# EAGLE design control board V2 (EAGLE 7.7.0)
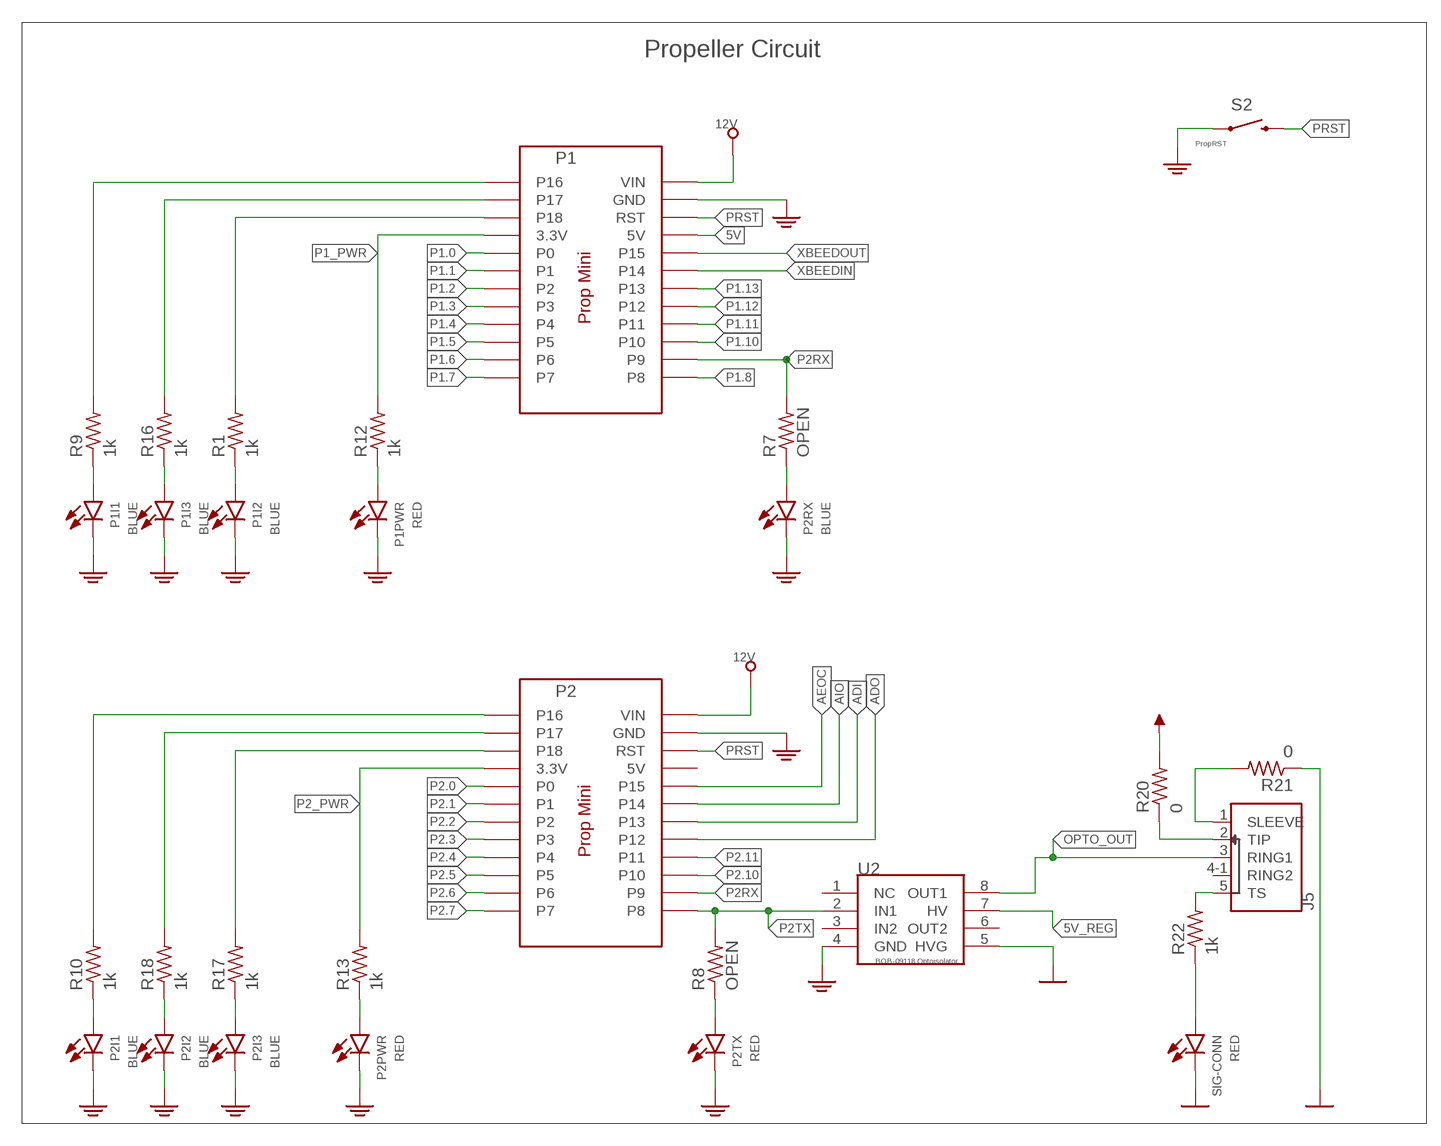
[diagram p0: schematic, sheet 1, part 1 of 2]
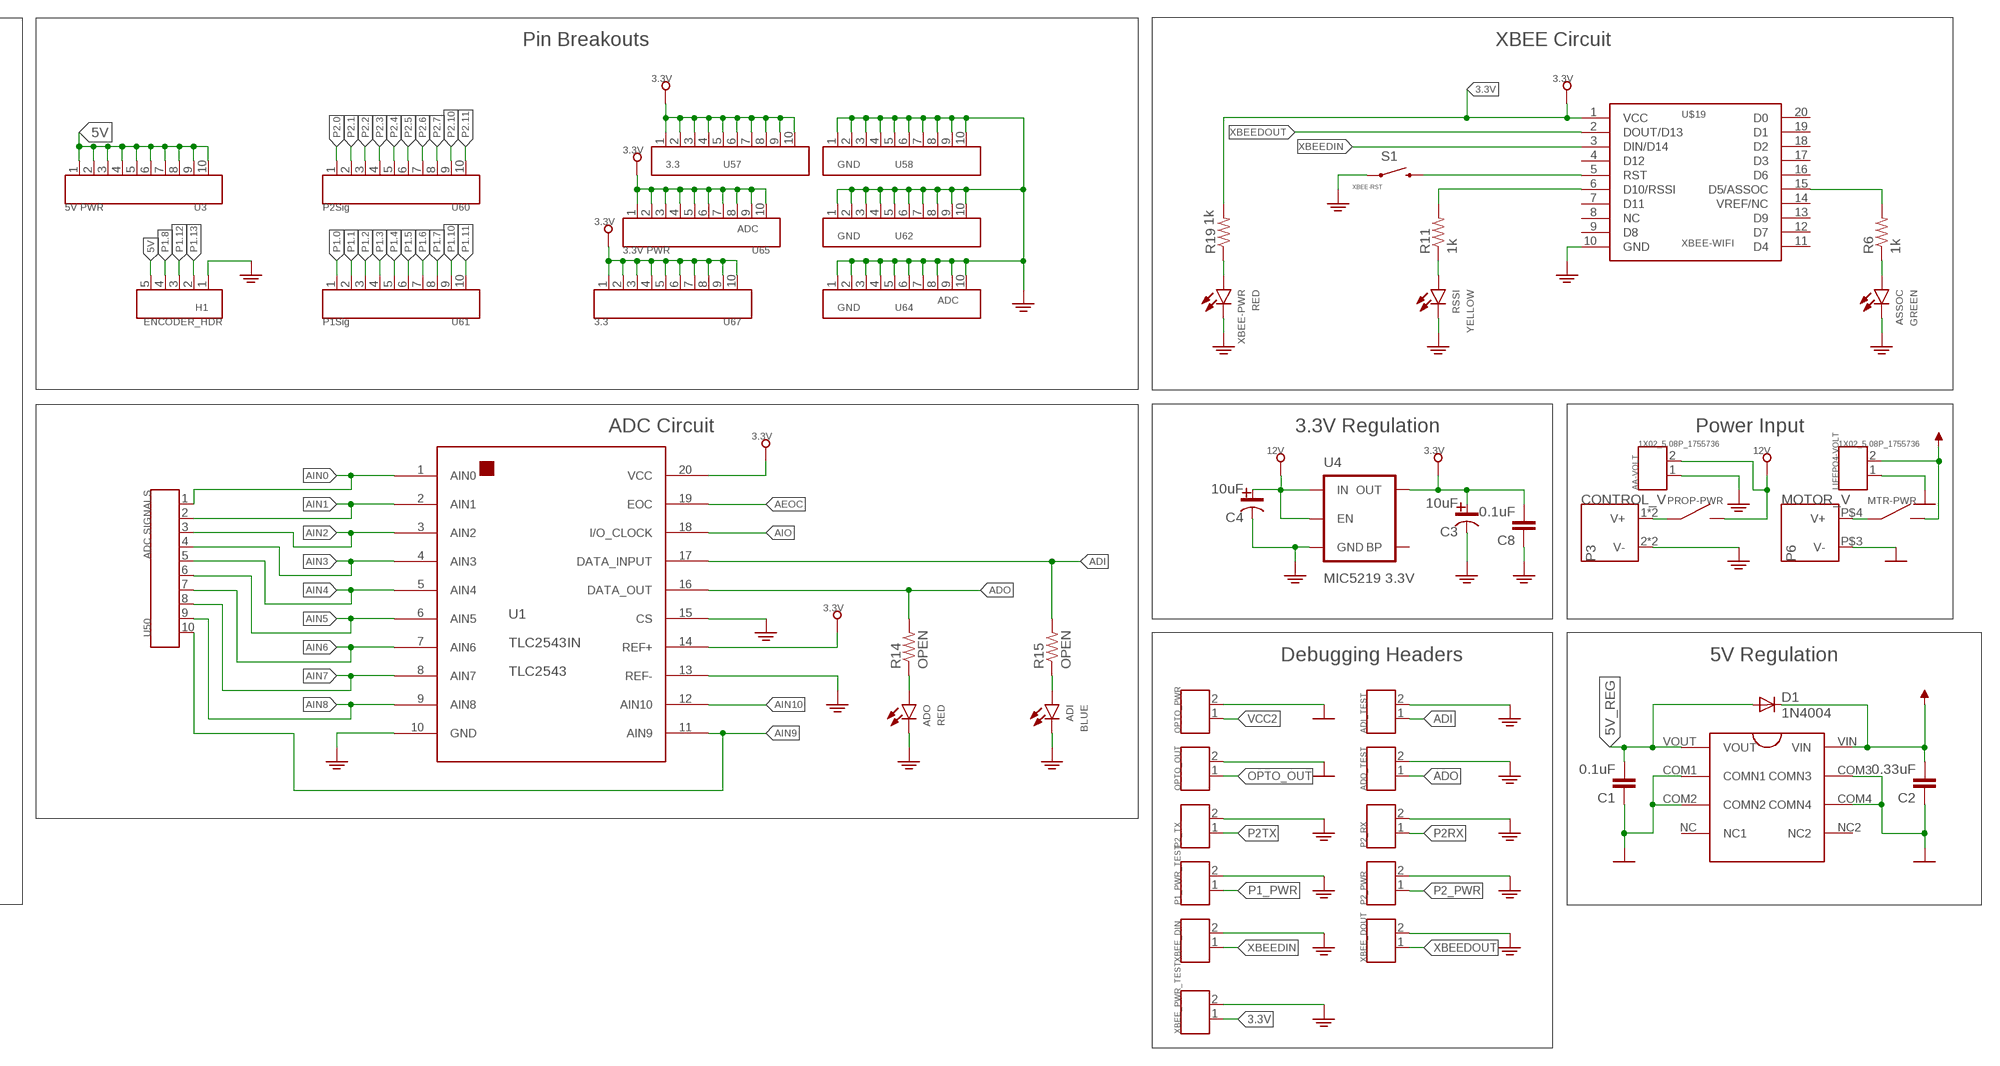
[diagram p1: schematic, sheet 1, part 2 of 2]

## Parts
AA-VOLT  1X02_5.08P_1755736  [DIP5.08MM-1X02]
ADI  BLUE  LED-STD  [0603]
ADI_TEST  1X02  [DIP0.1-1X02]
ADO  RED  LED-STD  [0603]
ADO_TEST  1X02  [DIP0.1-1X02]
ASSOC  GREEN  LED-STD  [0603]
C1  0.1uF  C0603  [0603]
C2  0.33uF  C0603  [0603]
C3  10uF  C-POL-T  [0603-POL]
C4  10uF  C-POL-T  [0603-POL]
C8  0.1uF  C0603  [0603]
D1  1N4004  [DO41-10]
H1  ENCODER_HDR  1X05  [DIP0.1-1X05]
J5  SJ1-42535TS  [SJ1-42534-SMT]
LIFEPO4-VOLT  1X02_5.08P_1755736  [DIP5.08MM-1X02]
MTR-PWR  A11JP  [NKK-SP-ASERIES]
OPTO_OUT  1X02  [DIP0.1-1X02]
OPTO_PWR  1X02  [DIP0.1-1X02]
P1  PROP-MINI  [PROP-MINI]
P1_PWR_TEST  1X02  [DIP0.1-1X02]
P1I1  BLUE  LED-STD  [0603]
P1I2  BLUE  LED-STD  [0603]
P1I3  BLUE  LED-STD  [0603]
P1PWR  RED  LED-STD  [0603]
P2  PROP-MINI  [PROP-MINI]
P2_PWR  1X02  [DIP0.1-1X02]
P2_RX  1X02  [DIP0.1-1X02]
P2_TX  1X02  [DIP0.1-1X02]
P2I1  BLUE  LED-STD  [0603]
P2I2  BLUE  LED-STD  [0603]
P2I3  BLUE  LED-STD  [0603]
P2PWR  RED  LED-STD  [0603]
P2RX  BLUE  LED-STD  [0603]
P2TX  RED  LED-STD  [0603]
P3  CONTROL_V  SINGLE-LINEPJ-014DH-SMT  [PJ-002BH-SMT-TR]
P6  MOTOR_V  SINGLE-LINE'  [PJ-037A]
PROP-PWR  A11JP  [NKK-SP-ASERIES]
R1  1k  R0603  [0603]
R6  1k  R0603  [0603]
R7  OPEN  R0603  [0603]
R8  OPEN  R0603  [0603]
R9  1k  R0603  [0603]
R10  1k  R0603  [0603]
R11  1k  R0603  [0603]
R12  1k  R0603  [0603]
R13  1k  R0603  [0603]
R14  OPEN  R0603  [0603]
R15  OPEN  R0603  [0603]
R16  1k  R0603  [0603]
R17  1k  R0603  [0603]
R18  1k  R0603  [0603]
R19  1k  R0603  [0603]
R20  0  R0603  [0603]
R21  0  R0603  [0603]
R22  1k  R0603  [0603]
RSSI  YELLOW  LED-STD  [0603]
S1  XBEE-RST  SWITCH-MOMENTARY-2SMD-2  [TACTILE_SWITCH_SMD-2]
S2  PropRST  SWITCH-MOMENTARY-2SMD-2  [TACTILE_SWITCH_SMD-2]
SIG-CONN  RED  LED-STD  [0603]
U1  TLC2543IN  [DIL-20]
U2  BOB-09118  [DIL08-0.1P-6W]
U3  5V PWR  1X10  [DIP0.1-1X10]
U4  MIC5219 3.3V  V_REG_MIC52193.3V  [SOT23-5]
U50  ADC SIGNALS  1X10  [DIP0.1-1X10]
U57  3.3  1X10  [DIP0.1-1X10]
U58  GND  1X10  [DIP0.1-1X10]
U60  P2Sig  1X10  [DIP0.1-1X10]
U61  P1Sig  1X10  [DIP0.1-1X10]
U62  GND  1X10  [DIP0.1-1X10]
U64  GND  1X10  [DIP0.1-1X10]
U65  3.3V PWR  1X10  [DIP0.1-1X10]
U67  3.3  1X10  [DIP0.1-1X10]
U70  R-PDSO-G8  [UA78L05ACDR]
U$19  XBEE-WIFI  [XBEE-STD]
XBEE-PWR  RED  LED-STD  [0603]
XBEE_DIN  1X02  [DIP0.1-1X02]
XBEE_DOUT  1X02  [DIP0.1-1X02]
XBEE_PWR_TEST  1X02  [DIP0.1-1X02]

## Nets
3.3V: C3.2 C8.2 R19.2 U1.14(REF+) U1.20(VCC) U4.5(OUT) U57.1 U57.2 U57.3 U57.4 U57.5 U57.6 U57.7 U57.8 U57.9 U57.10 U65.1 U65.2 U65.3 U65.4 U65.5 U65.6 U65.7 U65.8 U65.9 U65.10 U67.1 U67.2 U67.3 U67.4 U67.5 U67.6 U67.7 U67.8 U67.9 U67.10 U$19.1(VCC) XBEE_PWR_TEST.1
5V: H1.5 P1.5V U3.1 U3.2 U3.3 U3.4 U3.5 U3.6 U3.7 U3.8 U3.9 U3.10
5V_REG: C1.2 D1.A U2.7(HV) U70.VOUT
12V: AA-VOLT.2 C4.2 P1.VIN P2.VIN PROP-PWR.3 U4.1(IN) U4.3(EN)
ADI: ADI_TEST.1 P2.P13 R15.2 U1.17(DATA_INPUT)
ADO: ADO_TEST.1 P2.P12 R14.2 U1.16(DATA_OUT)
AEOC: P2.P15 U1.19(EOC)
AIN0: U1.1(AIN0) U50.1
AIN1: U1.2(AIN1) U50.2
AIN2: U1.3(AIN2) U50.3
AIN3: U1.4(AIN3) U50.4
AIN4: U1.5(AIN4) U50.5
AIN5: U1.6(AIN5) U50.6
AIN6: U1.7(AIN6) U50.7
AIN7: U1.8(AIN7) U50.8
AIN8: U1.9(AIN8) U50.9
AIN9: U1.11(AIN9) U50.10
AIN10: U1.12(AIN10)
AIO: P2.P14 U1.18(I/O_CLOCK)
GND: AA-VOLT.1 ADI.OUT ADI_TEST.2 ADO.OUT ADO_TEST.2 ASSOC.OUT C3.1 C4.1 C8.1 H1.1 P1.GND P1_PWR_TEST.2 P1I1.OUT P1I2.OUT P1I3.OUT P1PWR.OUT P2.GND P2_PWR.2 P2_RX.2 P2_TX.2 P2I1.OUT P2I2.OUT P2I3.OUT P2PWR.OUT P2RX.OUT P2TX.OUT P3.2(V-) P3.3(V-) RSSI.OUT S1.2 S2.2 U1.10(GND) U1.13(REF-) U1.15(CS) U2.4(GND) U4.2(GND) U58.1 U58.2 U58.3 U58.4 U58.5 U58.6 U58.7 U58.8 U58.9 U58.10 U62.1 U62.2 U62.3 U62.4 U62.5 U62.6 U62.7 U62.8 U62.9 U62.10 U64.1 U64.2 U64.3 U64.4 U64.5 U64.6 U64.7 U64.8 U64.9 U64.10 U$19.10(GND) XBEE-PWR.OUT XBEE_DIN.2 XBEE_DOUT.2 XBEE_PWR_TEST.2
GND2: C1.1 C2.1 LIFEPO4-VOLT.1 OPTO_OUT.2 OPTO_PWR.2 P6.P$3(V-) R21.1 SIG-CONN.OUT U2.5(HVG) U70.COM1(COMN1) U70.COM2(COMN2) U70.COM3(COMN3) U70.COM4(COMN4)
N$1: P3.1(V+) P3.1.(V+) PROP-PWR.1
N$2: P1I1.IN R9.1
N$3: P1.P18 R1.2
N$4: ADO.IN R14.1
N$5: R11.1 RSSI.IN
N$6: ADI.IN R15.1
N$7: MTR-PWR.1 P6.P$4(V+)
N$9: R6.2 U$19.15(D5/ASSOC)
N$10: ASSOC.IN R6.1
N$12: P1I3.IN R16.1
N$14: P1I2.IN R1.1
N$15: P1PWR.IN R12.1
N$16: R19.1 XBEE-PWR.IN
N$17: J5.1(SLEEVE) R21.2
N$18: P2RX.IN R7.1
N$19: P2I1.IN R10.1
N$20: S1.1 U$19.5(RST)
N$22: R11.2 U$19.6(D10/RSSI)
N$23: P1.P16 R9.2
N$24: P2I2.IN R18.1
N$25: P2.P16 R10.2
N$26: P2I3.IN R17.1
N$27: P1.P17 R16.2
N$28: P2PWR.IN R13.1
N$29: P2.P18 R17.2
N$30: P2TX.IN R8.1
N$31: P2.P17 R18.2
N$32: J5.2(TIP) R20.1
N$33: R22.1 SIG-CONN.IN
N$34: J5.5(TS) R22.2
OPTO_OUT: J5.3(RING1) OPTO_OUT.1 U2.8(OUT1)
P1.0: P1.P0 U61.1
P1.1: P1.P1 U61.2
P1.2: P1.P2 U61.3
P1.3: P1.P3 U61.4
P1.4: P1.P4 U61.5
P1.5: P1.P5 U61.6
P1.6: P1.P6 U61.7
P1.7: P1.P7 U61.8
P1.8: H1.4 P1.P8
P1.10: P1.P10 U61.9
P1.11: P1.P11 U61.10
P1.12: H1.3 P1.P12
P1.13: H1.2 P1.P13
P1_PWR: P1.3.3V P1_PWR_TEST.1 R12.2
P2.0: P2.P0 U60.1
P2.1: P2.P1 U60.2
P2.2: P2.P2 U60.3
P2.3: P2.P3 U60.4
P2.4: P2.P4 U60.5
P2.5: P2.P5 U60.6
P2.6: P2.P6 U60.7
P2.7: P2.P7 U60.8
P2.10: P2.P10 U60.9
P2.11: P2.P11 U60.10
P2_PWR: P2.3.3V P2_PWR.1 R13.2
P2RX: P1.P9 P2.P9 P2_RX.1 R7.2
P2TX: P2.P8 P2_TX.1 R8.2 U2.2(IN1)
PRST: P1.RST P2.RST S2.1
VCC2: C2.2 D1.C LIFEPO4-VOLT.2 MTR-PWR.3 OPTO_PWR.1 R20.2 U70.VIN
XBEEDIN: P1.P14 U$19.3(DIN/D14) XBEE_DIN.1
XBEEDOUT: P1.P15 U$19.2(DOUT/D13) XBEE_DOUT.1
Unconnected: J5.4-1(RING2) P2.5V U2.1(NC) U2.3(IN2) U2.6(OUT2) U4.4(BP) U70.NC2 U70.NC(NC1) U$19.4(D12) U$19.7(D11) U$19.8(NC) U$19.9(D8) U$19.11(D4) U$19.12(D7) U$19.13(D9) U$19.14(VREF/NC) U$19.16(D6) U$19.17(D3) U$19.18(D2) U$19.19(D1) U$19.20(D0)

## Notes on the sheet
- Propeller Circuit | Pin Breakouts | XBEE Circuit
- ADC
- ADC
- ADC Circuit | 3.3V Regulation | Power Input
- Debugging Headers | 5V Regulation

## Library data of the parts
AA-VOLT LIFEPO4-VOLT = headers:1X02_5.08P_1755736
ADI ADO ASSOC P1I1-P1I3 P1PWR P2I1-P2I3 P2PWR P2RX P2TX RSSI SIG-CONN XBEE-PWR = led:LED-STD
ADI_TEST ADO_TEST OPTO_OUT OPTO_PWR P1_PWR_TEST P2_PWR P2_RX P2_TX XBEE_DIN XBEE_DOUT XBEE_PWR_TEST = headers:1X02
C1 C2 C8 = RCL:C
C3 C4 = RCL:C-POL; CAP-TYPE: TANTALUM
D1 = diode:1N4004: DIODE general purpose rectifier, 1 A
H1 = headers:1X05
J5 = audio-connectors:SJ1-42535; MNT: SMT
MTR-PWR PROP-PWR = switches:A11JP
P1 P2 = Microcontrollers:PROP-MINI
P3 P6 = PWR-Connectors:SINGLE-LINE: 4UCON Part Num: 18742
R1 R6-R22 = RCL:R
S1 S2 = SparkFun-Electromechanical:SWITCH-MOMENTARY-2: Various NO switches- pushbuttons, reed, etc; PROD_ID: SWCH-09213
U1 = ADC:TLC2543IN
U2 = Optoisolation:BOB-09118
U3 U50 U57 U58 U60-U62 U64 U65 U67 = headers:1X10; DIP: 0.1
U4 = SparkFun-PowerIC:V_REG_MIC5219: V_REG MIC5219 Standard 3.3V and 5V 500mA LDO voltage regulator in SOT-23 layout. Micrel part MIC5219. BP (by-pass) pin is used to lower output noise with 470pF cap, may be left open.; PROD_ID: VREG-09872
U70 = Voltage Regulators:R-PDSO-G8
U$19 = RF:XBEE-WIFI

## Board
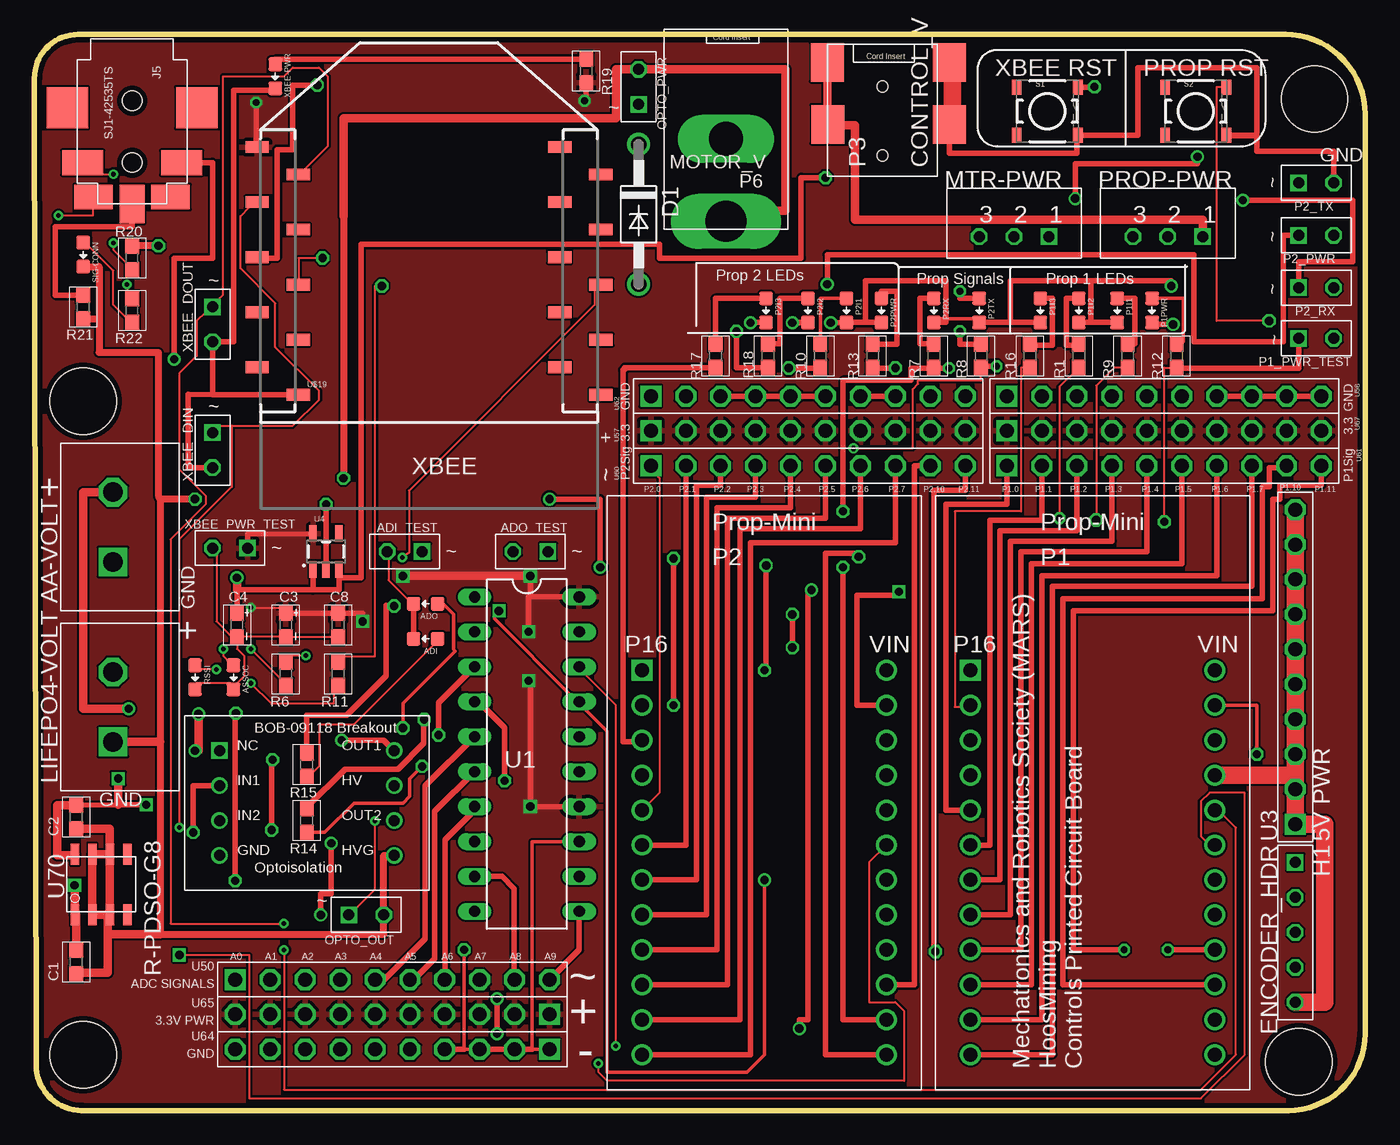
[diagram p2: board, top side]
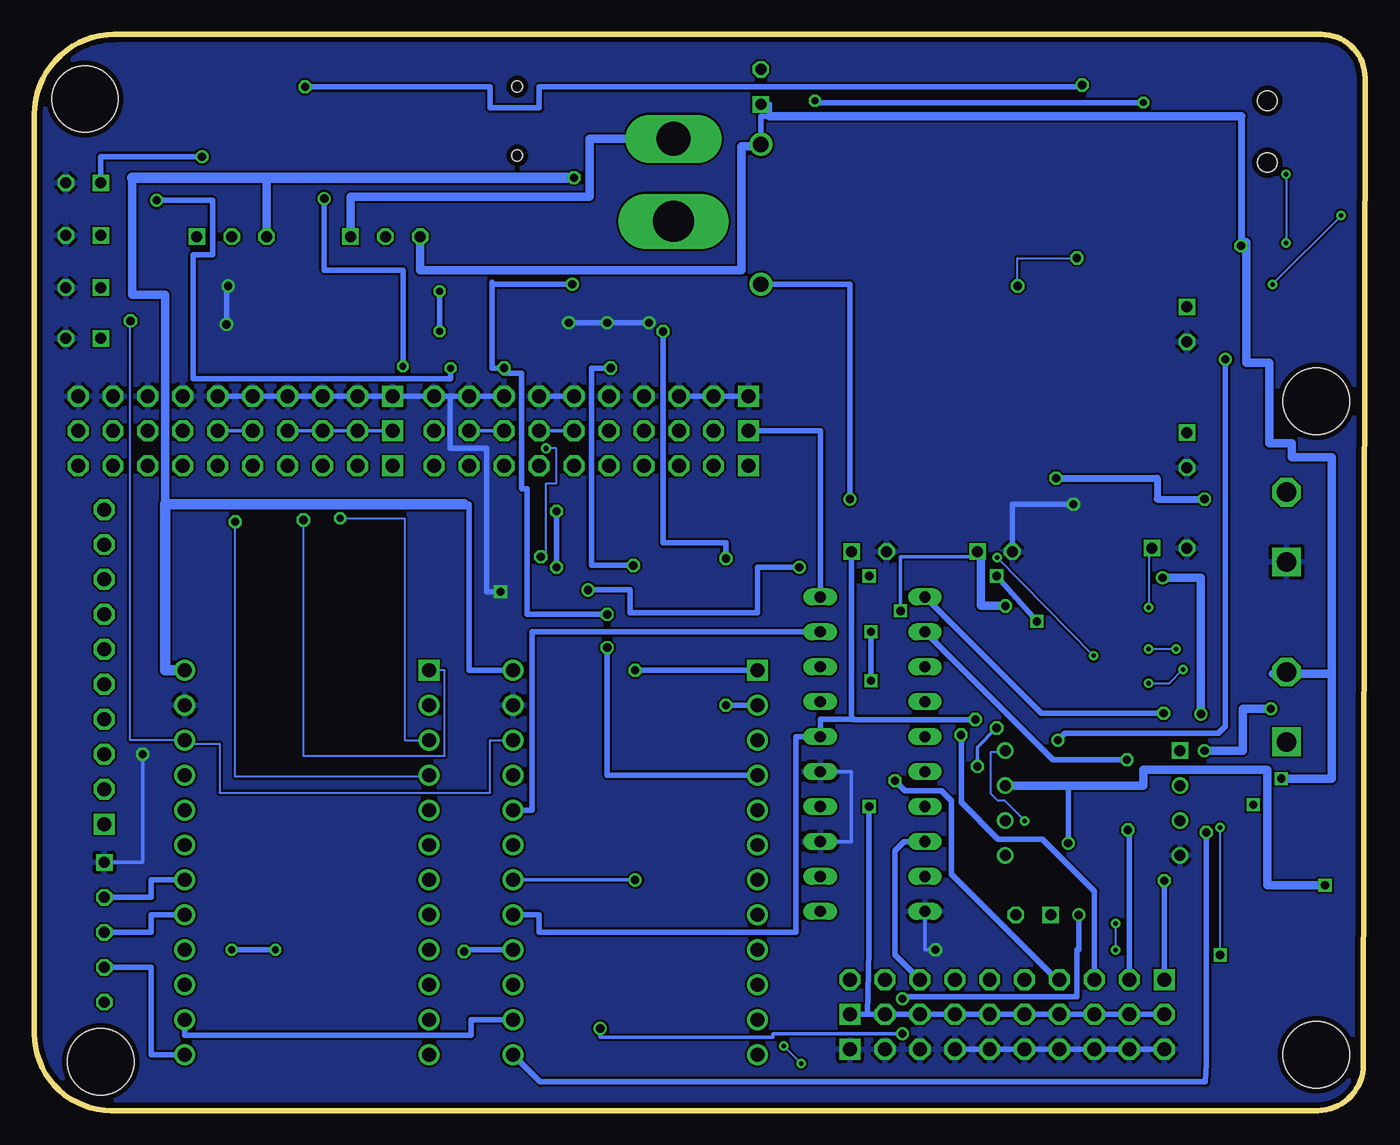
[diagram p3: board, bottom side, seen from below]

Size 96.77 x 78.23 mm. Coordinates in mm from the lower left corner, seen from the top.
Outline: 0.13,4.06 arc0 0.13,4.06 0.13,3.68
Outline: 0.13,3.68 0.13,3.33 arc90 3.46,0 91.18,0 arc90 96.77,5.59 96.77,72.41 arc90 90.96,78.23 3.18,78.23 arc90 0,75.05 0.13,3.68
Copper layers (1*16): Top 0.0356mm / dielectric 1.5011mm / Bottom 0.0356mm
Design rules "LaenPCBOrder": minimum track width 6mil, minimum drill 13mil, track to track 6mil, track to pad 6mil, pad to pad 6mil, via to via 6mil, smd to smd 6mil, copper to edge 15mil, drill to drill 6mil, minimum pad ring 7mil, minimum via ring 7mil, stop-mask expansion 3mil, vias tented up to drill 0mil, thermal gap 10mil
Holes 4.83 mm at 3.56,4.06 3.56,51.56 93.09,73.53 91.95,3.56

### Footprints (pad centres in the part's own frame; a part is rotated, then mirrored left to right if it is on the bottom)
DIP5.08MM-1X02 = drill 1.4 square: 1 0,0 | drill 1.4 octagon: 2 5.08,0
0603 = smd 1 x 1: IN 0,-0.877; OUT 0,0.877
DIP0.1-1X02 = drill 0.8 square: 1 0,-1.27 | drill 0.8 octagon: 2 0,1.27
0603' = smd 1.1 x 1: 1 -0.85,0; 2 0.85,0
0603-POL = smd 1.1 x 1: 1 -0.85,0; 2 0.85,0
DO41-10 = drill 1.118: A 5.08,0; C -5.08,0
DIP0.1-1X05 = drill 0.8 square: 1 0,-5.08 | drill 0.8 octagon: 2 0,-2.54; 3 0,0; 4 0,2.54; 5 0,5.08
SJ1-42534-SMT = smd 2.8 x 1.8: 1 7.5,0 | smd 1.8 x 3: 2 4.5,-3.6; 3 4.5,3.6 | smd 3 x 3: 4-1 0.5,4.7; 4-2 0.5,-4.7 | smd 1.8 x 2.8: 5 7,-2.8; 6 7,2.8 | hole 1.4: 0,0; 4.5,0
NKK-SP-ASERIES = drill 0.8 square: 1 2.54,-0.991 | drill 0.8 octagon: 2 0,-0.991; 3 -2.54,-0.991
PROP-MINI = drill 1.016: 3.3V -8.89,6.35; 5V 8.89,6.35; GND 8.89,11.43; P0 -8.89,3.81; P1 -8.89,1.27; P2 -8.89,-1.27; P3 -8.89,-3.81; P4 -8.89,-6.35; P5 -8.89,-8.89; P6 -8.89,-11.43; P7 -8.89,-13.97; P8 8.89,-13.97; P9 8.89,-11.43; P10 8.89,-8.89; P11 8.89,-6.35; P12 8.89,-3.81; P13 8.89,-1.27; P14 8.89,1.27; P15 8.89,3.81; P17 -8.89,11.43; P18 -8.89,8.89; RST 8.89,8.89; VIN 8.89,13.97 | drill 1.016 square: P16 -8.89,13.97
PJ-002BH-SMT-TR = smd 2.8 x 2.4: 1 -0.7,3.765; 1. 3.8,3.81; 2 -0.7,-5.08; 3 3.8,-5.08 | hole 0.8: -2.96,-0.2; 2.04,-0.2
PJ-037A = drill 2.997 pad 2.997 long: P$3 0.508,3.429 | drill 2.489 pad 2.489 long: P$4 0.508,-2.565
TACTILE_SWITCH_SMD-2 = smd 0.7 x 1.1: 1 2.225,1.75; 2 2.225,-1.75; 3 -2.225,-1.75; 4 -2.225,1.75
DIL-20 = drill 0.813 long: 1 -8.89,6.35; 2 -8.89,3.81; 3 -8.89,1.27; 4 -8.89,-1.27; 5 -8.89,-3.81; 6 -8.89,-6.35; 7 -8.89,-8.89; 8 -8.89,-11.43; 9 -8.89,-13.97; 10 -8.89,-16.51; 11 -1.27,-16.51; 12 -1.27,-13.97; 13 -1.27,-11.43; 14 -1.27,-8.89; 15 -1.27,-6.35; 16 -1.27,-3.81; 17 -1.27,-1.27; 18 -1.27,1.27; 19 -1.27,3.81; 20 -1.27,6.35
DIL08-0.1P-6W = drill 0.8 square: 1 -5.08,5.08 | drill 0.8: 2 -5.08,2.54; 3 -5.08,0; 4 -5.08,-2.54; 5 7.62,-2.54; 6 7.62,0; 7 7.62,2.54; 8 7.62,5.08
DIP0.1-1X10 = drill 1.016 square: 1 0,-11.43 | drill 1.016 octagon: 2 0,-8.89; 3 0,-6.35; 4 0,-3.81; 5 0,-1.27; 6 0,1.27; 7 0,3.81; 8 0,6.35; 9 0,8.89; 10 0,11.43
SOT23-5 = smd 0.55 x 1.2: 1 -0.95,-1.3; 2 0,-1.3; 3 0.95,-1.3; 4 0.95,1.3; 5 -0.95,1.3
UA78L05ACDR = smd 1.55 x 0.6: COM1 -2.4,0.73; COM2 -2.4,-0.54; COM3 2,0.73; COM4 2,-0.54; NC -2.4,-1.81; NC2 2,-1.81; VIN 2,2; VOUT -2.4,2
XBEE-STD = smd 1.7 x 0.85: 1 -12.5,8.57; 2 -9.5,6.57; 3 -12.5,4.57; 4 -9.5,2.57; 5 -12.5,0.57; 6 -9.5,-1.43; 7 -12.5,-3.43; 8 -9.5,-5.43; 9 -12.5,-7.43; 10 -9.5,-9.43; 11 12.5,-9.43; 12 9.5,-7.43; 13 12.5,-5.43; 14 9.5,-3.43; 15 12.5,-1.43; 16 9.5,0.57; 17 12.5,2.57; 18 9.5,4.57; 19 12.5,6.57; 20 9.5,8.57

### Placement (x,y rotation side)
AA-VOLT  5.71,39.88 90 top
ADI  28.45,34.29 90 top
ADI_TEST  26.92,40.64 90 top
ADO  28.45,36.83 90 top
ADO_TEST  36.07,40.64 90 top
ASSOC  14.48,31.5 180 top
C1  0.1uF  [0603']  3.05,10.79 90 top
C2  0.33uF  [0603']  3.05,21.34 90 top
C3  18.29,35.31 90 top
C4  14.73,35.31 90 top
C8  0.1uF  [0603']  22.1,35.31 90 top
D1  43.94,65.15 270 top
H1  91.69,12.95 180 top
J5  7.11,73.41 270 top
LIFEPO4-VOLT  5.71,26.8 90 top
MTR-PWR  71.25,64.52 0 top
OPTO_OUT  24.13,14.22 270 top
OPTO_PWR  43.94,74.42 0 top
P1  76.96,18.03 0 top
P1_PWR_TEST  93.22,56.13 270 top
P1I1  78.74,58.17 180 top
P1I2  75.95,58.17 180 top
P1I3  73.15,58.17 180 top
P1PWR  81.28,58.17 180 top
P2  53.09,18.03 0 top
P2_PWR  93.22,63.63 270 top
P2_RX  93.22,59.82 270 top
P2_TX  93.22,67.44 270 top
P2I1  59.05,58.17 180 top
P2I2  56.26,58.17 180 top
P2I3  53.21,58.17 180 top
P2PWR  61.59,58.17 180 top
P2RX  65.41,58.17 180 top
P2TX  68.71,58.17 180 top
P3  61.47,72.39 90 top
P6  50.8,68.07 180 top
PROP-PWR  82.42,64.52 0 top
R1  1k  [0603']  75.95,54.86 270 top
R6  1k  [0603']  18.29,31.75 90 top
R7  OPEN  [0603']  65.41,54.86 270 top
R8  OPEN  [0603']  68.83,54.86 270 top
R9  1k  [0603']  79.5,54.86 270 top
R10  1k  [0603']  57.15,54.86 270 top
R11  1k  [0603']  22.1,31.75 90 top
R12  1k  [0603']  83.06,54.86 270 top
R13  1k  [0603']  60.96,54.86 270 top
R14  OPEN  [0603']  19.81,21.08 90 top
R15  OPEN  [0603']  19.81,25.15 90 top
R16  1k  [0603']  72.39,54.86 270 top
R17  1k  [0603']  49.53,54.86 270 top
R18  1k  [0603']  53.34,54.86 270 top
R19  1k  [0603']  40.13,75.56 270 top
R20  0  [0603']  7.11,61.98 90 top
R21  0  [0603']  3.56,58.42 90 top
R22  1k  [0603']  7.11,58.17 90 top
RSSI  11.68,31.5 180 top
S1  73.66,72.64 0 top
S2  84.45,72.64 0 top
SIG-CONN  3.56,62.23 180 top
U1  40.89,30.99 0 top
U2  18.54,21.08 0 top
U3  91.69,32.26 0 top
U4  21.21,40.64 0 top
U50  26.04,9.53 270 top
U57  56.26,49.4 270 top
U58  82.17,51.94 270 top
U60  56.26,46.86 270 top
U61  82.17,46.86 270 top
U62  56.26,51.94 270 top
U64  26.04,4.45 90 top
U65  26.04,6.98 90 top
U67  82.17,49.4 270 top
U70  4.95,16.64 90 top
U$19  28.7,61.47 0 top
XBEE-PWR  17.53,75.18 180 top
XBEE_DIN  12.95,48.01 180 top
XBEE_DOUT  12.95,57.15 180 top
XBEE_PWR_TEST  14.22,40.89 90 top

### Tracks (layer width: path | path; a pad name or v marks a point on that pad's centre or on a via)
3.3V  (via drill 0.33, 0.5, 0.6)
  Top 0.152: v15.75,36.56 18.25,36.56 C3.2
  Top 0.406: U$19.1 16.13,70.04 v16.13,73.28 | v40.01,73.41 40.13,73.41 R19.2 | U1.20 36.07,37.34 | 36.07,37.34 35.94,37.34 v35.94,34.8 | v35.94,31.24 36.07,31.24 v36.07,22.1 U1.14 | C3.2 C8.2 23.88,36.16 v23.88,35.56 | v36.07,38.86 36.07,37.34 | U4.5 15.49,41.91 XBEE_PWR_TEST.1
  Top 0.61: v26.8,38.86 v36.07,38.86
  Bottom 0.152: v15.75,36.56 15.75,40.56 XBEE_PWR_TEST.1
  Bottom 0.254: U57.6 U57.7 | U57.8 U57.9 | U67.1 U67.2 U67.3 U67.4 | U67.5 U67.6
  Bottom 0.406: v16.13,73.28 40.01,73.28 v40.01,73.41 | U57.1 39.62,49.4 U1.20 | v35.94,34.8 v35.94,31.24 | v23.88,35.56 v26.8,38.86 | v36.07,22.1 36.07,11.68 36.2,6.98 | 36.2,6.98 U65.1 | 36.2,6.98 U65.2 U65.3 U65.4 U65.5 U65.6 U65.7 U65.8 U65.9 U65.10
  pour Top: -2.03,80.01 -2.41,-1.4 96.9,-0.13 97.28,79.12
5V
  Top 1.27: P1.5V 91.69,24.38 | 91.69,24.38 U3.2 U3.1 93.85,20.83 93.85,7.87 H1.5 | 91.69,24.38 91.69,25.78 91.82,25.78 91.82,25.91 U3.3 U3.4 U3.5 U3.6 U3.7 U3.8 U3.9 U3.10
5V_REG  (via drill 0.6)
  Top 0.406: v21.59,19.43 21.59,15.75 20.83,15.75 v20.83,14.22 | v33.66,8.13 v33.66,5.59 | v37.47,44.45 41.15,44.45 v41.15,39.5 | v56.52,37.85 56.26,37.85 56.26,6.6 55.63,6.6 v55.63,5.97
  Top 0.61: C1.2 3.05,14.24 U70.VOUT 2.92,14.24 v2.92,16.38
  Bottom 0.254: v33.66,5.59 43.05,5.59 43.05,5.33 55.63,5.33 v55.63,5.97
  Bottom 0.406: U2.7 21.59,23.62 v21.59,19.43 | v20.83,14.22 20.83,11.68 20.95,11.68 20.95,8.25 33.66,8.25 v33.66,8.13 | D1.A 37.47,60.07 v37.47,44.45 | v41.15,39.5 44.2,39.5 44.2,36.2 53.47,36.2 53.47,37.85 v56.52,37.85 | v55.63,5.97 55.63,5.59
  Bottom 0.61: v2.92,16.38 7.11,16.38 7.11,24.77 16.13,24.77 16.13,23.62 U2.7
12V  (via drill 0.6)
  Top 0.152: 14.75,36.56 C4.2
  Top 0.406: U4.1 20.26,37.85 | 20.26,37.85 14.73,37.85 C4.2 | 22.16,38.73 22.16,37.85 20.26,37.85 | U4.3 22.16,38.73 | 22.16,38.73 23.75,38.73 23.75,62.99 45.47,62.99 45.47,61.98 55.75,61.98 55.75,67.82 v57.53,67.82
  Top 0.61: AA-VOLT.2 3.56,44.96 3.56,29.21 v6.86,29.21 | v11.68,26.16 11.94,26.16 v11.94,28.83 | v14.73,38.73 14.73,37.85
  Bottom 0.406: 65.53,44.07 65.15,44.07 65.15,32 P2.VIN
  Bottom 0.61: 77.85,67.82 79.88,67.82 PROP-PWR.3 | 89.66,67.82 89.66,59.31 87.25,59.31 87.25,44.07 | v6.86,29.21 8.89,29.21 8.89,26.16 v11.68,26.16 | v11.94,28.83 11.94,38.73 v14.73,38.73
  Bottom 0.762: v57.53,67.82 77.85,67.82 89.66,67.82 | P1.VIN 87.25,32 87.25,44.07 65.53,44.07
ADI  (via drill 0.6)
  Top 0.152: 39.12,30.1 U1.17 39.75,29.46
  Top 0.254: 39.12,30.1 33.46,35.75 33.46,36.32 v33.78,36.32 | v53.09,16.76 53.09,4.06 51.82,2.79 41.66,2.79 41.66,27.56 39.75,29.46
  Top 0.406: R15.2 19.81,28.73 22.71,28.73 25.58,31.6 25.58,36.73 v26.16,36.68
  Bottom 0.254: v53.09,16.76 P2.P13 | v33.78,36.32 33.78,40.26 28.19,40.26 ADI_TEST.1
  Bottom 0.61: ADI_TEST.1 27.94,40.64 27.94,36.7 26.16,36.7 v26.16,36.68
ADO  (via drill 0.6)
  Top 0.406: R14.2 19.81,22.05 22.58,24.82 26.44,24.82 28.32,26.7 28.32,28.4 v28.35,28.42
  Bottom 0.406: ADO_TEST.1 37.34,28.6 | 37.34,28.6 37.34,28.45 39.62,28.45 U1.16 41.4,27.18 41.4,12.95 60.07,12.95 60.07,14.22 P2.P12 | v28.35,28.42 37.16,28.42 37.34,28.6
AEOC
  Bottom 0.406: P2.P15 60.58,21.84 60.58,34.8 U1.19
AIN0  (via drill 0.6)
  Top 0.406: v14.61,16.71 14.61,28.83 v14.66,28.88
  Bottom 0.406: U50.1 v14.61,16.71 | v14.66,28.88 23.55,28.88 U1.1
AIN1  (via drill 0.6)
  Top 0.406: v17.25,20.4 17.25,25.43 v17.32,25.5
  Bottom 0.406: U50.2 17.14,20.3 v17.25,20.4 | v17.32,25.5 22.71,25.5 U1.2
AIN2  (via drill 0.6)
  Top 0.406: v29.39,27.3 29.39,29.64 U1.3
  Bottom 0.406: U50.3 19.68,15.95 23.47,19.74 26.7,19.74 29.36,22.4 29.36,27.28 v29.39,27.3
AIN3  (via drill 0.6)
  Top 0.406: U1.4 32.31,29.72 34.19,27.84 v34.19,23.98
  Bottom 0.406: U50.4 22.43,9.53 30.07,17.17 30.07,22.5 30.81,23.24 33.45,23.24 v34.19,23.98
AIN4
  Top 0.406: U50.5 25.45,9.53 28.42,12.5 28.42,23.6 U1.5
AIN5
  Top 0.406: U50.6 27.58,9.53 29.11,11.05 29.11,21.74 U1.6
AIN6
  Top 0.406: U1.7 32,21.82 29.87,19.69 29.87,9.55 U50.7
AIN7
  Bottom 0.406: U1.8 33.53,19.56 34.19,18.9 34.19,11.33 U50.8
AIN8
  Top 0.406: U1.9 34.01,17.02 34.9,16.13 34.9,9.55 U50.9
AIN9
  Top 0.406: U1.11 39.62,11.68 U50.10
AIO  (via drill 0.33)
  Top 0.152: v42.29,4.7 42.29,29.46 39.75,32 U1.18 | v41.02,3.43 41.02,2.79 41.66,2.16 63.25,2.16 63.25,7.24 62.61,7.87 60.71,7.87 60.71,18.03 P2.P14
  Bottom 0.152: v41.02,3.43 v42.29,4.7
GND  (via drill 0.6)
  Top 0.152: 65.75,57.56 P2RX.OUT | 68.25,57.56 P2TX.OUT | 66.75,76.06 P3.3 | 66.75,72.06 P3.2 | RSSI.OUT 11.75,31.06 14.25,31.06 ASSOC.OUT 14.75,31.06 15.25,31.56 15.25,33.06 14.75,33.56 14.75,34.06 C4.1 | ADO.OUT 27.25,37.06 25.75,38.56 25.75,40.56 ADI_TEST.2 | C4.1 14.25,34.56 13.25,35.56 13.25,40.56 XBEE_PWR_TEST.2 | C4.1 C3.1 C8.1
  Top 0.254: 68.25,57.56 65.75,57.56 | P1.GND 88.9,29.46 v88.9,25.91 | v31.24,11.68 31.24,4.45 U64.3 | U1.13 36.2,19.56 36.2,4.45 U64.1
  Top 0.406: XBEE-PWR.OUT 17.53,74.17 14.48,74.17 14.48,55.88 XBEE_DOUT.2 12.95,52.04 | 12.95,52.04 U$19.10 | ADI.OUT ADO.OUT | 12.95,52.04 11.18,52.07 11.18,46.74 XBEE_DIN.2 | U4.2 v21.21,44.07 | P3.2 66.55,69.6 75.82,69.6 75.82,70.89 S1.2 80.26,70.89 80.26,75.82 88.9,75.82 88.9,70.87 86.68,70.87 S2.2 88.9,70.89 88.9,69.72 94.49,69.72 P2_TX.2 | U62.3 U62.4 U62.5 U62.6 | U62.7 U62.8 | U58.7 U58.8 U58.9 U58.10 | U64.4 31.24,4.45 | U64.3 U64.2 36.2,4.45 | P2.GND 59.82,29.46 59.82,37.47 62.87,37.47 v62.87,37.72 | P2I3.OUT 52.2,57.29 v52.07,57.28 | v57.91,57.28 P2I1.OUT 60.45,57.29 | 60.45,57.29 P2PWR.OUT | P2RX.OUT 66.29,57.29 66.29,60.33 60.45,60.33 60.45,57.29 | P2TX.OUT 70.99,57.29 | 70.99,57.29 P1I3.OUT | 76.83,57.29 P1I2.OUT P1I1.OUT 76.83,57.29 | 76.83,60.33 70.99,60.33 70.99,57.29 | 76.83,57.29 76.83,60.33 | 76.83,60.33 82.68,60.33 v82.68,59.94 | v82.8,57.15 81.28,57.15 P1PWR.OUT | v55.12,57.28 P2I2.OUT 55.12,57.29 v55.12,57.28
  Top 1.27: 66.75,76.06 66.75,71.89 P3.2
  Bottom 0.152: 67.06,51.99 67.06,51.69 U62.10
  Bottom 0.254: v88.9,25.91 88.9,18.03 H1.1 | U1.10 32,11.68 v31.24,11.68 | U1.15 37.34,24.64 37.34,19.56 U1.13
  Bottom 0.406: v21.21,44.07 25.65,44.07 ADI_TEST.2 | U62.1 U62.2 U62.3 | U62.6 U62.7 | U62.8 U62.9 66.55,51.94 | 66.55,51.94 U62.10 U58.1 U58.2 U58.3 U58.4 U58.5 U58.6 | U64.10 U64.9 U64.8 U64.7 U64.6 U64.5 U64.4 | v62.87,37.72 63.88,37.72 63.88,48.13 66.55,48.13 66.55,51.94 | v52.07,57.28 v55.12,57.28 v57.91,57.28 | v82.68,59.94 82.8,59.94 v82.8,57.15
  pour Bottom: -2.29,80.26 -2.54,2.18 arc90 -0.74,-1.01 97.03,-0.25 97.28,79.63
GND2  (via drill 0.6)
  Top 0.406: 50.29,65.41 P6.P$3
  Top 0.508: U2.5 25.4,18.54 OPTO_OUT.2 25.4,12.83 9.14,12.83 9.14,26.8 9.14,44.45 | SIG-CONN.OUT 4.7,61.35 4.7,57.53 | 4.7,57.53 3.56,57.53 R21.1 | 4.7,57.53 4.7,55.12 9.02,55.12 9.02,44.7 9.14,44.45 | 22.48,65.02 v22.48,45.97 | v11.68,44.45 9.14,44.45
  Top 0.61: 50.29,65.41 54.61,65.41 54.61,75.69 OPTO_PWR.2 42.29,75.69 42.29,72.14 22.48,72.14 22.48,65.02 | U70.COM4 U70.COM2 | U70.COM4 U70.COM3 U70.COM1 5.46,14.24 5.46,14.22 | 5.46,14.1 5.46,14.22 | 5.46,14.22 5.33,14.22 5.33,12.83 | 5.33,12.83 5.33,10.03 3.05,10.03 C1.1 | 9.14,12.83 5.33,12.83 | C2.1 5.49,20.49 U70.COM4 | LIFEPO4-VOLT.1 9.14,26.8
  Bottom 0.508: v22.48,45.97 15.11,45.97 15.11,44.45 v11.68,44.45
N$1
  Top 0.61: P3.1. 57.66,71.69 P3.1 57.7,71.63 59.69,71.63 59.69,64.77 61.34,64.77 61.72,64.77 84.96,64.77 PROP-PWR.1
N$2
  Top 0.406: P1I1.IN 80.01,59.04 80.01,55.75 79.5,55.75 R9.1
N$3  (via drill 0.5)
  Top 0.152: R1.2 74.55,52.62 v74.55,43.05
  Bottom 0.152: v74.55,43.05 69.85,43.05 69.85,26.92 P1.P18
N$4  (via drill 0.6)
  Top 0.254: R14.1 21.12,20.23 23.24,22.35 26.8,22.35 27.3,22.86 27.3,24.13 v28.19,25.02 | v26.8,27.81 26.8,29.59 30.61,33.4 30.48,33.53 30.48,36.07 29.72,36.83 ADO.IN
  Bottom 0.254: v28.19,25.02 28.19,26.42 v26.8,27.81
N$5  (via drill 0.33)
  Top 0.152: v13.25,32.06 11.75,32.06 RSSI.IN | v15.75,31.06 17.25,29.56 21.75,29.56 21.75,30.56 R11.1
  Bottom 0.152: v13.25,32.06 14.25,31.06 v15.75,31.06
N$6
  Top 0.152: ADI.IN 29.25,34.06 23.25,28.06 20.75,28.06 20.75,25.06 20.25,24.56 R15.1
N$7
  Bottom 0.61: P6.P$4 56.39,70.64 56.39,66.42 73.79,66.42 MTR-PWR.1
N$9  (via drill 0.33)
  Top 0.152: v19.75,33.06 18.75,33.06 R6.2 | v26.75,40.19 27.25,40.56 27.25,45.06 40.75,58.56 40.75,60.06 U$19.15
  Bottom 0.152: v26.75,40.19 v19.75,33.06
N$10  (via drill 0.33)
  Top 0.152: v13.75,33.56 13.75,33.06 14.25,32.56 ASSOC.IN | v15.75,33.56 18.25,31.06 R6.1
  Bottom 0.152: v15.75,33.56 v13.75,33.56
N$12
  Top 0.406: P1I3.IN 74.04,59.04 74.04,55.63 72.39,55.63 R16.1
N$14
  Top 0.406: P1I2.IN 75.06,59.04 75.06,55.63 75.95,55.63 R1.1
N$15
  Top 0.254: P1PWR.IN 83.57,59.04 83.57,55.88 83.06,55.88 R12.1
N$16
  Top 0.406: R19.1 17.53,76.41 XBEE-PWR.IN
N$17
  Top 0.406: J5.1 7.11,64.26 1.52,64.26 1.52,59.27 R21.2
N$18
  Top 0.406: P2RX.IN 64.39,59.04 64.39,55.75 65.41,55.75 R7.1
N$19
  Top 0.254: P2I1.IN 57.15,59.04 R10.1
N$20  (via drill 0.6)
  Top 0.406: S1.1 77.09,74.39 v77.09,74.42 | v20.57,74.55 18.8,74.55 18.8,69.85 17.65,69.85 17.65,61.98 16.2,61.98 U$19.5
  Bottom 0.406: v77.09,74.42 63.63,74.42 63.63,72.9 60.07,72.9 60.07,74.42 20.57,74.42 v20.57,74.55
N$22  (via drill 0.6)
  Top 0.152: R11.2 22.1,33.02 24.76,33.02 24.76,59.94 v25.27,59.94 | v20.95,61.98 19.2,61.98 U$19.6
  Bottom 0.152: v25.27,59.94 25.27,61.98 v20.95,61.98
N$23  (via drill 0.6)
  Top 0.152: R9.2 78.52,54.01 77.22,52.7 v77.22,42.93
  Bottom 0.152: v77.22,42.93 77.22,25.78 66.93,25.78 66.93,32 P1.P16
N$24
  Top 0.406: P2I2.IN 54.23,59.04 54.23,55.75 53.34,55.75 R18.1
N$25  (via drill 0.6)
  Top 0.406: v53.09,32 53.21,32 v53.21,39.62 | v54.86,53.98 57.15,53.98 R10.2
  Bottom 0.406: P2.P16 v53.09,32 | v53.21,39.62 56.26,39.62 56.26,53.98 v54.86,53.98
N$26
  Top 0.406: P2I3.IN 49.53,59.04 R17.1
N$27
  Top 0.152: R16.2 71.75,54.01 71.75,43.56 66.93,43.56 66.93,29.34 68.07,29.34 P1.P17
N$28
  Top 0.406: R13.1 62.74,55.71 62.74,59.56 61.59,59.56 P2PWR.IN
N$29
  Top 0.406: R17.2 42.93,54.01 42.93,53.85 42.8,53.85 42.8,26.8 44.2,26.8 P2.P18
N$30  (via drill 0.5)
  Top 0.406: P2TX.IN 67.56,59.04 67.56,59.05 67.31,59.05 v67.31,59.56 | v67.31,56.64 67.31,55.71 R8.1
  Bottom 0.406: v67.31,59.56 v67.31,56.64
N$31  (via drill 0.6)
  Top 0.406: R18.2 51.05,54.01 v51.05,56.64 | v46.48,40.13 v46.48,29.46
  Bottom 0.406: v51.05,56.64 51.05,41.27 46.48,41.27 v46.48,40.13 | v46.48,29.46 P2.P17
N$32  (via drill 0.33)
  Top 0.152: v5.75,63.06 5.75,62.56 6.75,61.56 R20.1 | v5.75,68.06 3.75,68.06 3.75,68.56 J5.2
  Bottom 0.152: v5.75,68.06 v5.75,63.06
N$33
  Top 0.152: SIG-CONN.IN 3.75,63.06 5.75,61.06 5.75,58.56 6.75,57.56 R22.1
N$34  (via drill 0.33)
  Top 0.152: v6.75,60.06 6.75,59.06 R22.2 | v1.75,65.06 4.25,65.06 4.25,66.06 J5.5
  Bottom 0.152: v1.75,65.06 v6.75,60.06
OPTO_OUT  (via drill 0.33, 0.6)
  Top 0.152: v24.75,21.06 24.75,16.06 23.25,14.56 OPTO_OUT.1
  Top 0.406: J5.3 12.95,68.91 12.95,61.98 10.16,61.98 v10.16,54.61 | v22.35,26.92 25.4,26.92 U2.8
  Bottom 0.152: v24.75,21.06 26.25,22.56 26.75,22.56 27.25,23.06 27.25,26.06 26.25,26.06 U2.8
  Bottom 0.406: v10.16,54.61 10.16,27.94 10.67,27.43 21.84,27.43 v22.35,26.92
P1.0
  Top 0.406: P1.P0 66.29,21.84 66.29,44.07 70.74,44.07 U61.1
P1.1
  Top 0.406: P1.P1 69.47,19.3 69.47,42.93 73.28,42.93 U61.2
P1.2
  Top 0.406: P1.P2 70.23,16.76 70.23,42.16 75.82,42.16 U61.3
P1.3
  Top 0.406: P1.P3 70.99,14.22 70.99,41.4 78.36,41.4 U61.4
P1.4
  Top 0.406: P1.P4 71.75,11.68 71.75,40.64 80.9,40.64 U61.5
P1.5
  Top 0.406: P1.P5 72.52,9.14 72.52,39.75 83.44,39.75 U61.6
P1.6
  Top 0.406: P1.P6 73.28,6.6 73.28,38.86 85.98,38.86 U61.7
P1.7
  Top 0.406: P1.P7 74.04,4.06 74.04,38.1 88.52,38.1 U61.8
P1.8
  Bottom 0.406: H1.4 88.27,10.41 88.27,4.06 P1.P8
P1.10
  Top 0.406: P1.P10 74.8,9.14 74.8,37.21 89.28,37.21 89.28,45.34 89.79,45.34 89.79,46.74 91.06,46.74 U61.9
P1.11  (via drill 0.5)
  Top 0.406: U61.10 93.6,45.47 90.55,45.47 90.55,44.45 90.04,44.45 90.04,36.32 75.56,36.32 75.56,11.68 v79.25,11.68 | v82.42,11.68 P1.P11
  Bottom 0.406: v79.25,11.68 v82.42,11.68
P1.12
  Bottom 0.406: H1.3 88.27,12.95 88.27,14.22 P1.P12
P1.13
  Bottom 0.406: H1.2 88.27,15.49 88.27,16.76 P1.P13
P1_PWR  (via drill 0.6)
  Top 0.152: v82.17,42.8 82.17,54.01 R12.2
  Top 0.406: R12.2 83.06,53.98 91.95,53.98 P1_PWR_TEST.1
  Bottom 0.152: P1.3.3V 68.07,24.26 82.17,24.26 v82.17,42.8
P2.0
  Top 0.152: P2.P0 45.47,23.11 45.47,45.97 44.83,46.61 U60.1
P2.1
  Top 0.406: P2.P1 47.37,19.3 U60.2
P2.2
  Top 0.406: P2.P2 48.13,16.76 48.13,45.47 49.91,45.47 U60.3
P2.3
  Top 0.406: P2.P3 48.9,14.22 48.9,44.58 52.45,44.58 U60.4
P2.4
  Top 0.406: P2.P4 49.66,11.68 49.66,43.81 54.99,43.81 U60.5
P2.5
  Top 0.406: P2.P5 50.42,9.14 50.42,43.05 57.53,43.05 U60.6
P2.6
  Top 0.406: P2.P6 51.31,6.6 51.31,42.29 60.07,42.29 U60.7
P2.7
  Top 0.406: P2.P7 52.07,4.06 52.07,41.27 62.61,41.27 U60.8
P2.10
  Top 0.406: P2.P10 64.01,9.14 64.01,46.86 U60.9
P2.11  (via drill 0.6)
  Top 0.406: v65.53,11.56 65.41,11.56 65.41,45.09 67.69,45.09 U60.10
  Bottom 0.406: P2.P11 65.53,11.68 v65.53,11.56
P2_PWR  (via drill 0.6)
  Top 0.406: v55.12,33.66 v55.12,36.07 | v62.61,53.98 60.96,53.98 R13.2 | P2_PWR.1 90.8,63.63 90.8,55.88 84.33,55.88 84.33,62.23 57.66,62.23 v57.66,60.07
  Bottom 0.406: P2.3.3V 55.12,24.38 v55.12,33.66 | v55.12,36.07 60.96,36.07 60.96,45.21 61.34,45.21 61.34,53.59 62.61,53.59 v62.61,53.98 63.5,53.98 63.5,60.07 | v57.66,60.07 63.5,60.07 | 63.5,60.07 63.5,60.2
P2RX  (via drill 0.5, 0.6)
  Top 0.406: v66.5,53.98 65.41,53.98 | 65.41,53.98 R7.2 | 65.41,53.98 63.75,53.98 63.75,53.09 58.8,53.09 v58.8,43.56 | v58.8,39.5 58.8,6.6 P2.P9 | v87.88,66.17 95.88,66.17 95.88,61.72 91.95,61.72 P2_RX.1
  Bottom 0.406: P2.P9 65.02,6.6 65.02,5.46 85.85,5.46 P1.P9 | v58.8,43.56 v58.8,39.5 | v66.5,53.98 66.5,53.21 85.22,53.21 85.22,62.23 83.82,62.23 83.82,66.17 v87.88,66.17
P2TX  (via drill 0.38, 0.5, 0.6)
  Top 0.152: v59.56,48.13 63.88,48.13 63.88,52.45 64.26,52.83 64.26,53.09 68.83,53.09 R8.2
  Top 0.406: 68.83,53.98 R8.2 68.83,54.1 v69.98,54.1 | P2.P8 57.53,4.06 57.53,40.51 59.94,40.51 v59.94,40.26 | U2.2 11.56,23.62 v11.56,20.22 | v75.69,66.29 75.69,68.83 84.58,68.83 v84.58,69.34
  Bottom 0.152: v59.94,40.26 59.56,40.26 59.56,45.59 58.8,45.59 58.8,48.13 v59.56,48.13
  Bottom 0.406: v69.98,54.1 69.98,61.09 75.69,61.09 v75.69,66.29 | v11.56,20.22 11.56,3.4 11.61,2.08 60,2.08 P2.P8 | v84.58,69.34 91.95,69.34 P2_TX.1
PRST  (via drill 0.6)
  Top 0.152: v89.79,57.4 85.98,57.4 85.98,74.42 86.68,74.42 S2.1
  Bottom 0.152: P2.RST 63.63,26.92 63.63,23.11 83.31,23.11 83.31,26.67 85.85,26.67 P1.RST 89.79,26.92 v89.79,57.4
VCC2  (via drill 0.6)
  Top 0.406: C2.2 6.1,22.22 6.82,22.23 v8.13,22.23
  Top 0.508: v9.02,62.87 7.11,62.87 R20.2
  Top 0.61: C2.2 1.65,22.19 1.65,18.54 2.95,18.54 U70.VIN | v6.1,24.13 6.1,22.22
  Bottom 0.152: 8.64,63.12 v9.02,62.87
  Bottom 0.406: 9.02,72.26 9.02,72.14 | v8.13,22.23 8,22.35 | OPTO_PWR.1 43.82,73.15 43.82,73.28 | OPTO_PWR.1 43.31,73.15 43.31,72.26 43.94,72.26 D1.C | 43.94,73.03 OPTO_PWR.1
  Bottom 0.508: 9.02,72.14 v9.02,62.87
  Bottom 0.61: 43.31,72.26 9.02,72.26 | 8.64,63.12 8.64,54.36 6.98,54.36 6.98,48.51 5.33,48.51 5.33,47.5 2.41,47.5 2.41,31.75 | D1.C 43.94,70.1 45.34,70.1 45.34,61.09 68.71,61.09 MTR-PWR.3 | 2.41,31.75 6.73,31.75 LIFEPO4-VOLT.2 | v6.1,24.13 2.41,24.13 2.41,31.75
XBEEDIN  (via drill 0.33, 0.6)
  Top 0.152: 14.35,49.78 13.08,49.78 XBEE_DIN.1 | 14.35,49.78 18.8,49.78 20.7,51.69 20.7,52.32 17.53,55.5 17.53,58.67 14.99,61.21 14.99,65.02 15.62,65.66 U$19.3 | v10.54,20.57 10.54,41.53 14.35,45.34 14.35,49.78 | P1.P14 85.47,19.3 84.84,19.94 84.84,22.48 85.47,23.11 88.01,23.11 88.01,4.06 84.84,0.89 15.62,0.89 15.62,11.3 v10.54,11.3
  Bottom 0.152: v10.54,11.3 v10.54,20.57
XBEEDOUT  (via drill 0.33)
  Top 0.152: U$19.2 19.43,68.2 21.34,70.1 21.34,75.18 20.7,75.82 18.8,75.82 18.16,75.18 13.72,75.18 13.72,59.31 13.08,58.67 XBEE_DOUT.1 12.45,58.04 11.81,57.4 11.81,54.86 10.54,53.59 10.54,46.61 12.45,44.7 12.45,44.07 9.91,41.53 9.91,13.59 v18.16,13.59 | v18.16,11.68 18.16,1.52 84.84,1.52 87.38,4.06 87.38,20.57 86.11,21.84 P1.P15
  Bottom 0.152: v18.16,13.59 v18.16,11.68

### Text on the board
tPlace: XBEE RST | PROP RST | ~ | GND | ~ | ~ | ~ | Prop 2 LEDs | Prop Signals | Prop 1 LEDs | ~ | ~ | ~ | + | ~ | P2.0 | P2.1 | P2.2 | P2.3 | P2.4 | P2.5 | P2.6 | P2.7 | P2.10 | P2.11 | P1.0 | P1.1 | P1.2 | P1.3 | P1.4 | P1.5 | P1.6 | P1.7 | P1.10 | P1.11 | + | ~ | ~ | ~ | GND | + | GND | ~ | A0 | A1 | A2 | A3 | A4 | A5 | A6 | A7 | A8 | A9 | ~ | + | - | Mechatronics and Robotics Society (MARS) / HoosMining / Controls Printed Circuit Board